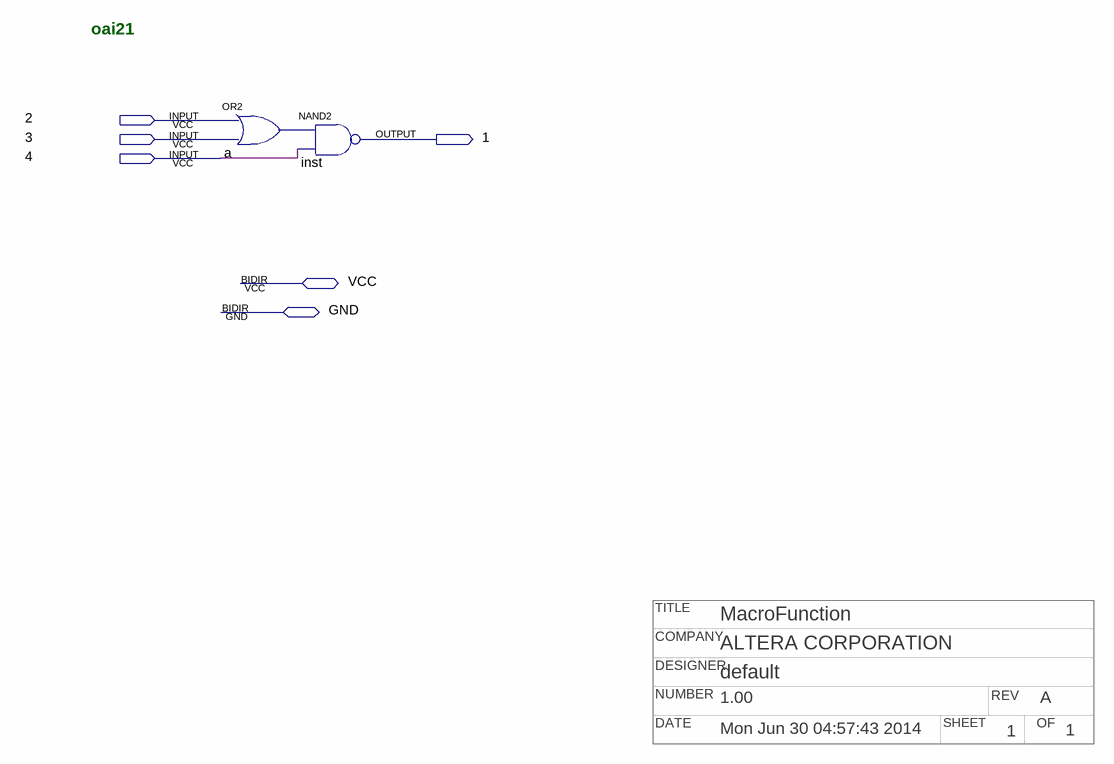
[diagram p0: schematic sheet]
// Quartus schematic npoai21.bdf as structural Verilog: 2 symbols, 6 pins
// Title block: TITLE: MacroFunction; COMPANY: ALTERA CORPORATION; DESIGNER: default; NUMBER: 1.00; REV: A; DATE: Mon Jun 30 04:57:43 2014; SHEET: 1; OF: 1
module npoai21 (
  input  \2 ,
  input  \3 ,
  input  \4 ,
  inout  VCC,
  inout  GND,
  output \1 
);

  wire a_out;

  or a (a_out, \2 , \3 );
  nand inst (\1 , a_out, \4 );

  // Notes on the sheet:
  //   oai21
endmodule
